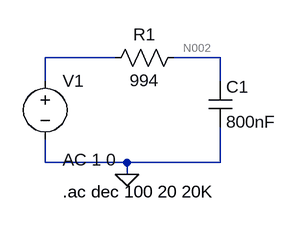
[diagram p0: schematic Low pass filter no load.asc]
Low pass filter no load.asc, the LTspice schematic file:
Version 4
SHEET 1 880 680
WIRE 192 112 96 112
WIRE 336 112 272 112
WIRE 96 144 96 112
WIRE 336 144 336 112
WIRE 96 256 96 224
WIRE 208 256 96 256
WIRE 336 256 336 208
WIRE 336 256 208 256
WIRE 208 272 208 256
FLAG 208 272 0
SYMBOL voltage 96 128 R0
WINDOW 123 24 124 Left 2
WINDOW 39 0 0 Left 0
SYMATTR InstName V1
SYMATTR Value ""
SYMATTR Value2 AC 1 0
SYMBOL res 288 96 R90
WINDOW 0 0 56 VBottom 2
WINDOW 3 32 56 VTop 2
SYMATTR InstName R1
SYMATTR Value 994
SYMBOL cap 320 144 R0
SYMATTR InstName C1
SYMATTR Value 800nF
TEXT 120 296 Left 2 !.ac dec 100 20 20K

The netlist it stands for:
* Low pass filter no load.asc
V1 N001 0 AC 1 0
R1 N002 N001 994
C1 N002 0 800nF
.ac dec 100 20 20K
.backanno
.end

* Results of the author's LTspice run, read from the files saved beside the schematic
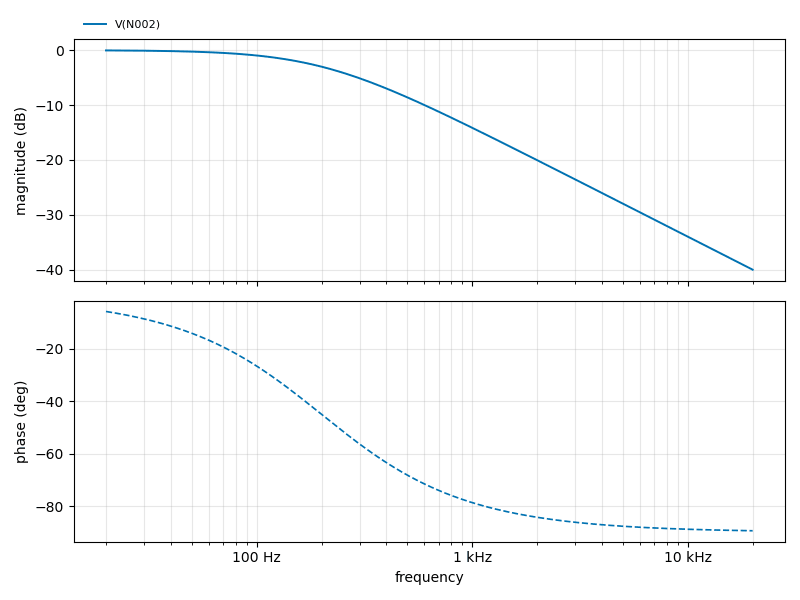
[diagram p1: AC Analysis of Low pass filter no load.asc, plotted from the saved traces]
* AC Analysis, 1 run:
*   V(N002): -0.04 dB at 20 Hz, -39.99 dB at 20 kHz, peak -0.04 dB at 20 Hz, 3 dB below the peak at 202.1 Hz